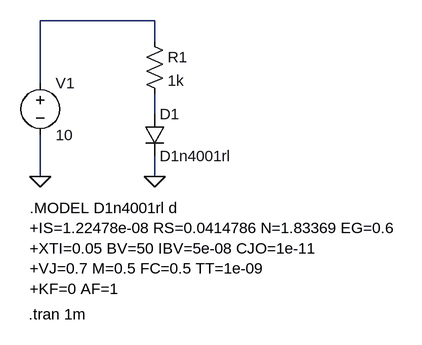
[diagram p0: schematic Diode.asc]
Diode.asc, the LTspice schematic file:
Version 4
SHEET 1 880 680
WIRE 240 32 64 32
WIRE 240 64 240 32
WIRE 64 128 64 32
WIRE 240 176 240 144
WIRE 64 272 64 208
WIRE 240 272 240 240
FLAG 240 272 0
FLAG 64 272 0
SYMBOL res 224 48 R0
SYMATTR InstName R1
SYMATTR Value 1k
SYMBOL diode 224 176 R0
SYMATTR InstName D1
SYMATTR Value D1n4001rl
SYMBOL voltage 64 112 R0
WINDOW 123 0 0 Left 0
WINDOW 39 0 0 Left 0
SYMATTR InstName V1
SYMATTR Value 10
TEXT 48 320 Left 2 !.MODEL D1n4001rl d\n+IS=1.22478e-08 RS=0.0414786 N=1.83369 EG=0.6\n+XTI=0.05 BV=50 IBV=5e-08 CJO=1e-11\n+VJ=0.7 M=0.5 FC=0.5 TT=1e-09\n+KF=0 AF=1
TEXT 46 484 Left 2 !.tran 1m

The netlist it stands for:
* Diode.asc
R1 N001 N002 1k
D1 N002 0 D1n4001rl
V1 N001 0 10
.model D D
.lib standard.dio
.MODEL D1n4001rl d
+IS=1.22478e-08 RS=0.0414786 N=1.83369 EG=0.6
+XTI=0.05 BV=50 IBV=5e-08 CJO=1e-11
+VJ=0.7 M=0.5 FC=0.5 TT=1e-09
+KF=0 AF=1
.tran 1m
.backanno
.end